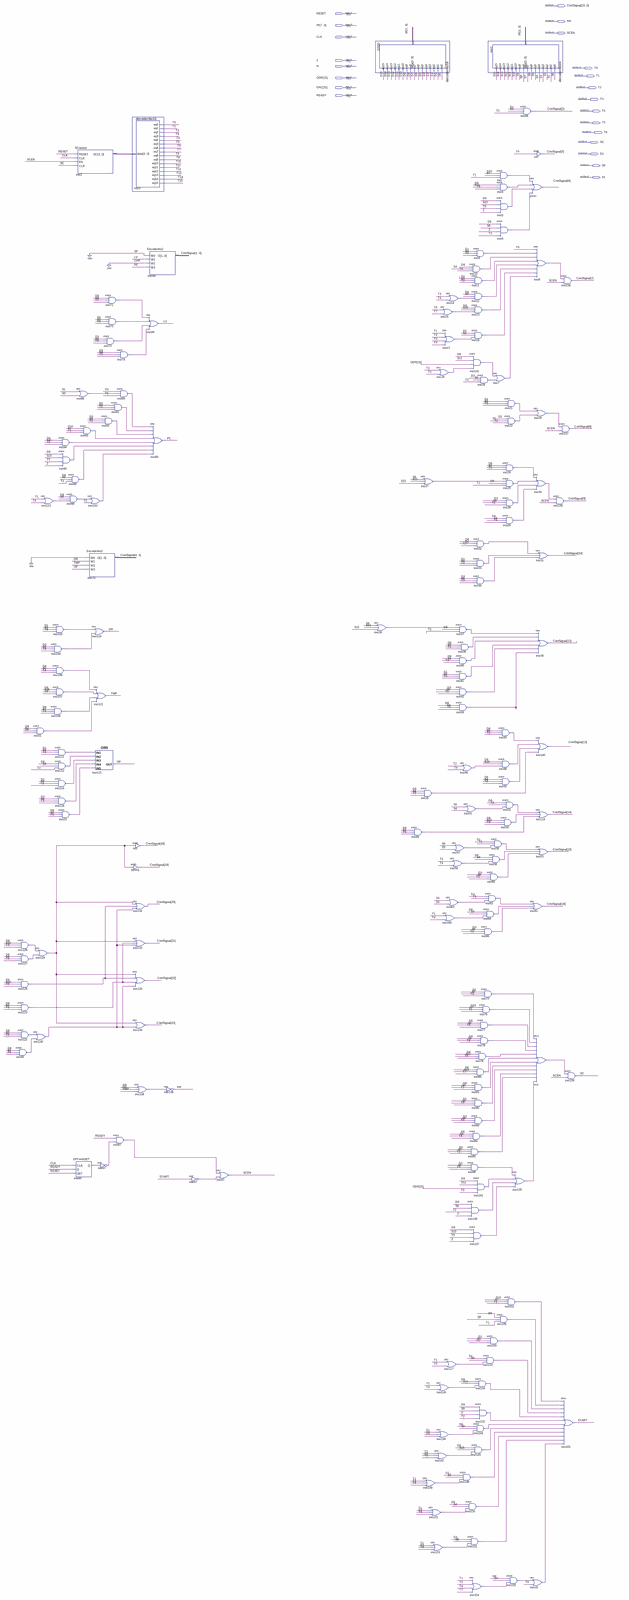
[diagram p0: schematic sheet, whole]
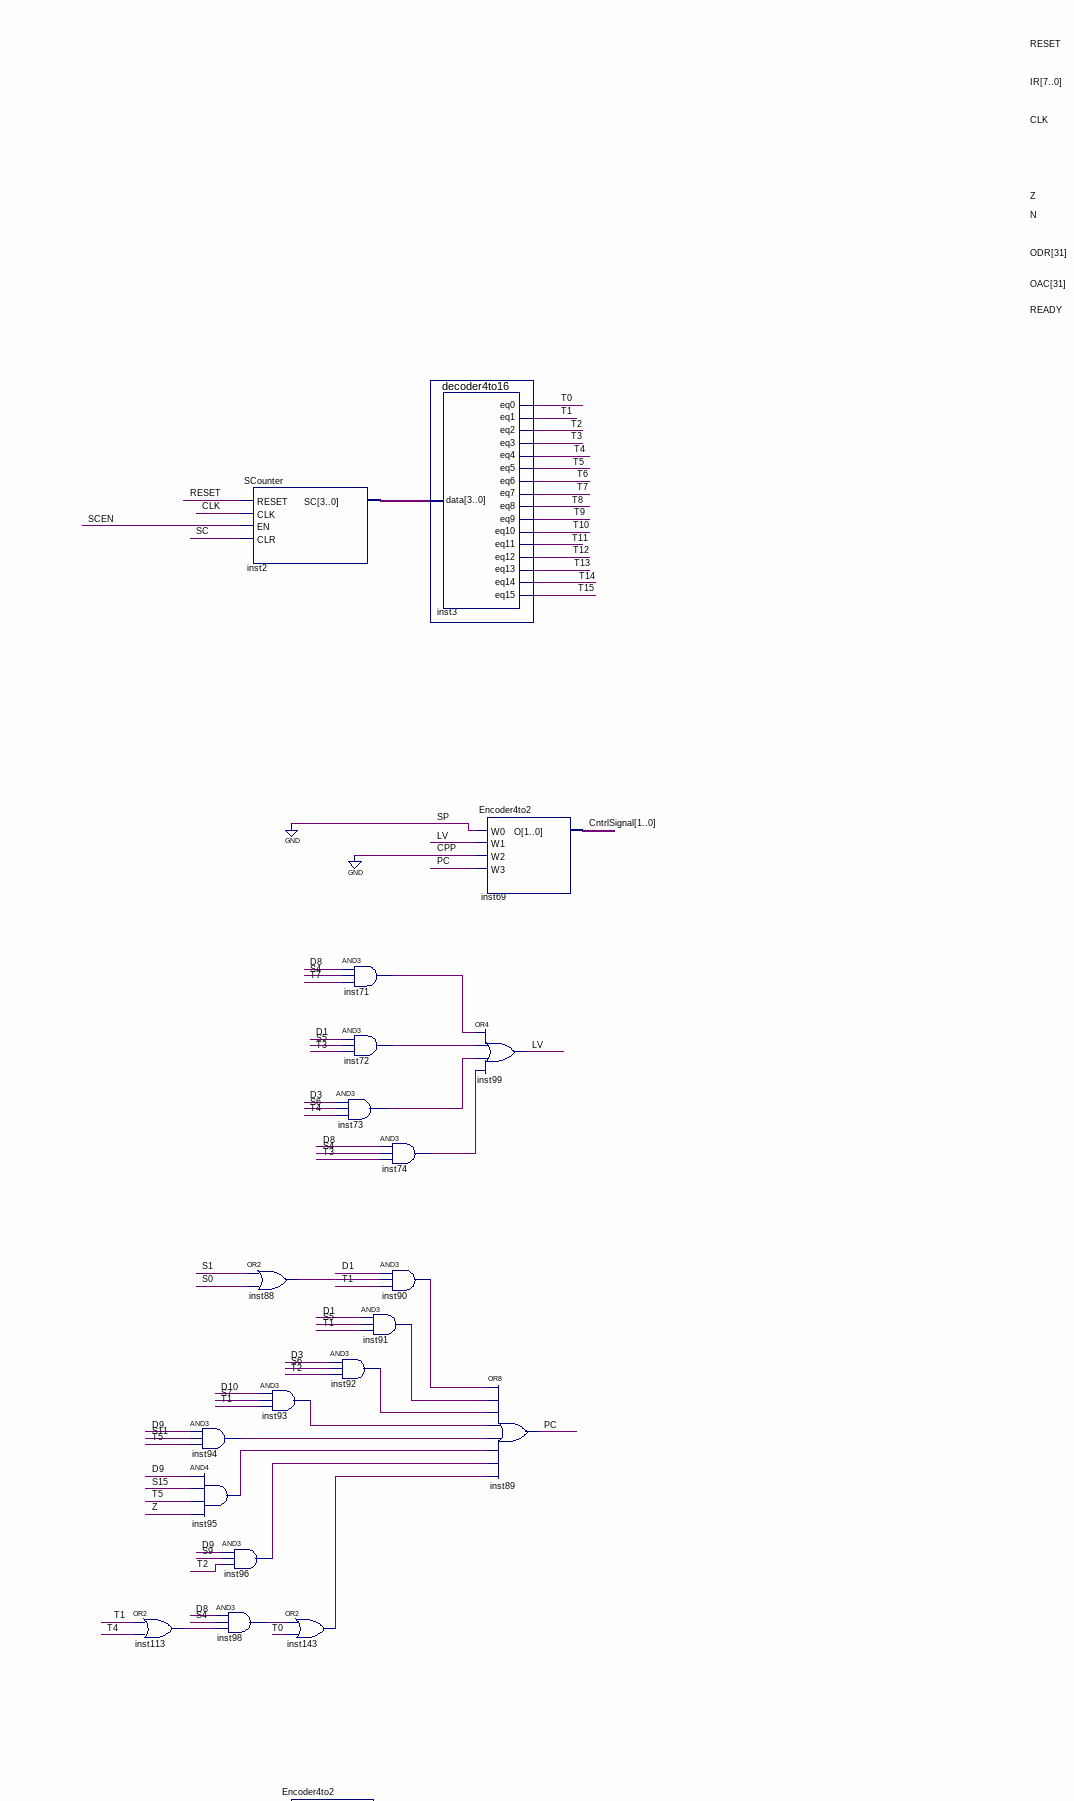
[diagram p1: schematic sheet, upper left part]
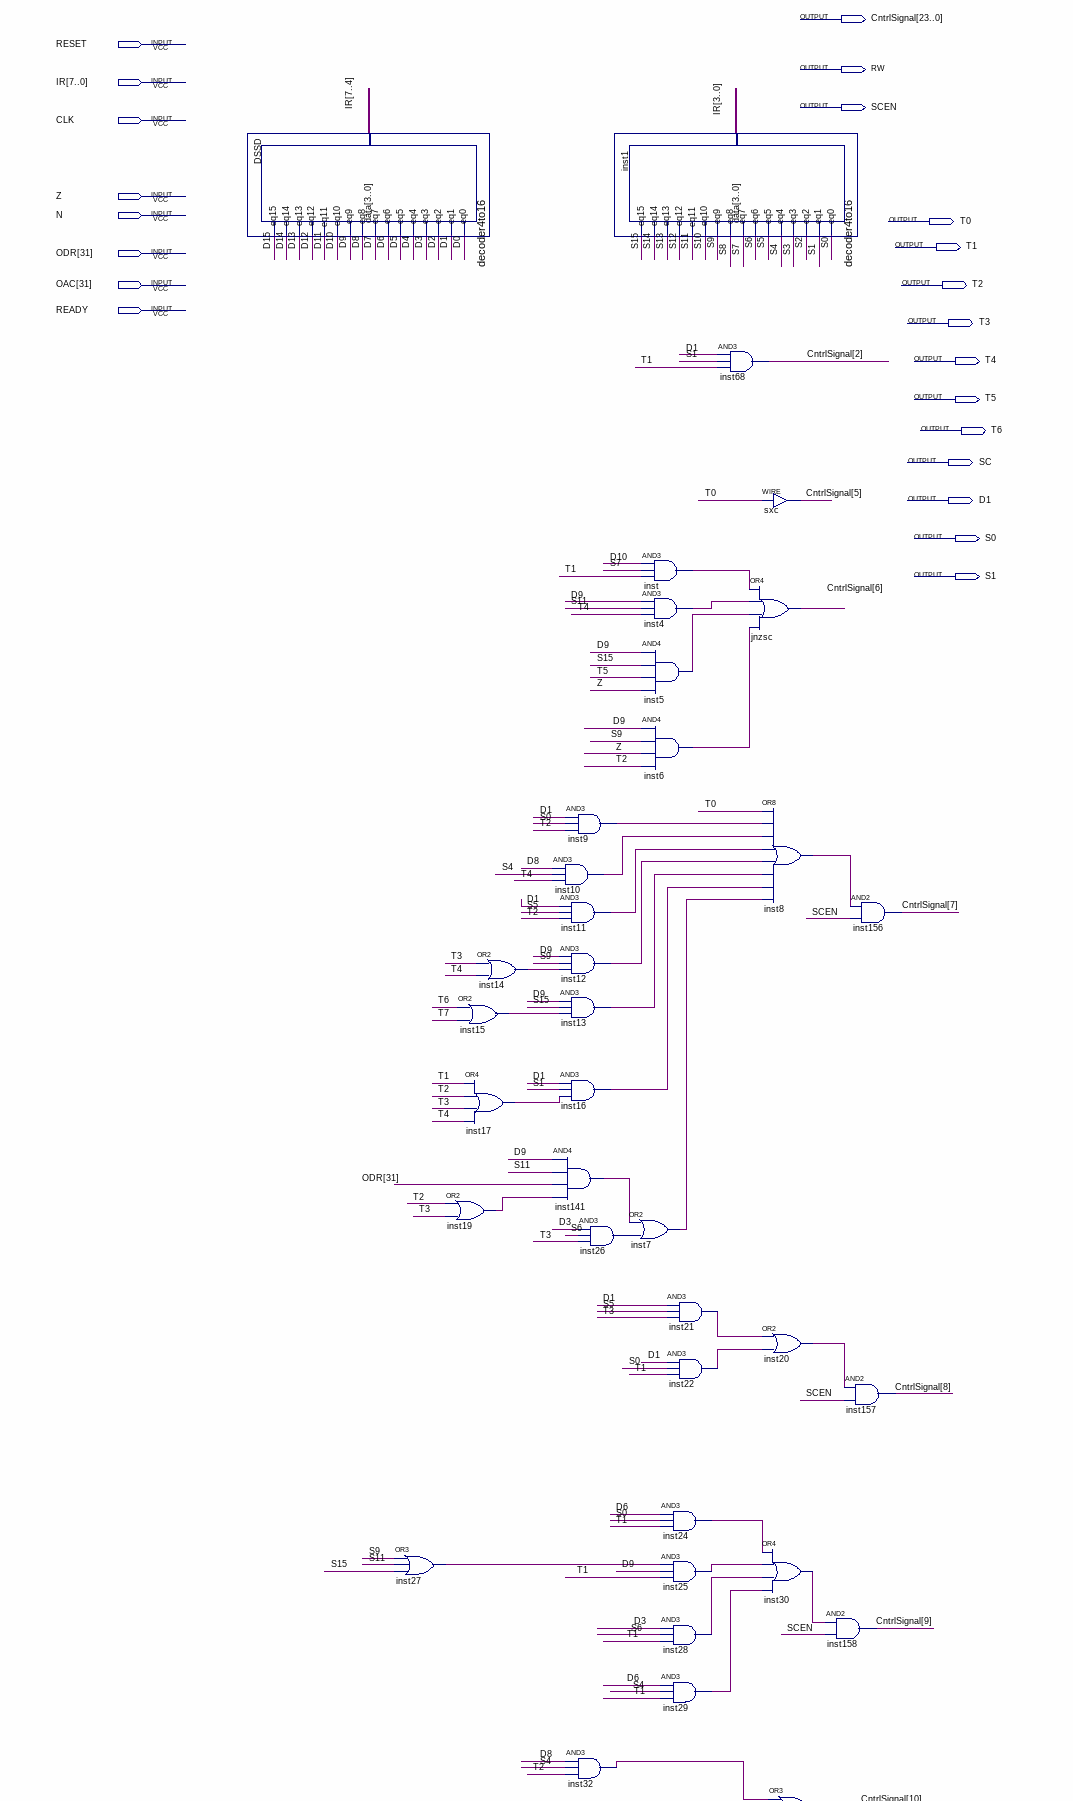
[diagram p2: schematic sheet, upper right part]
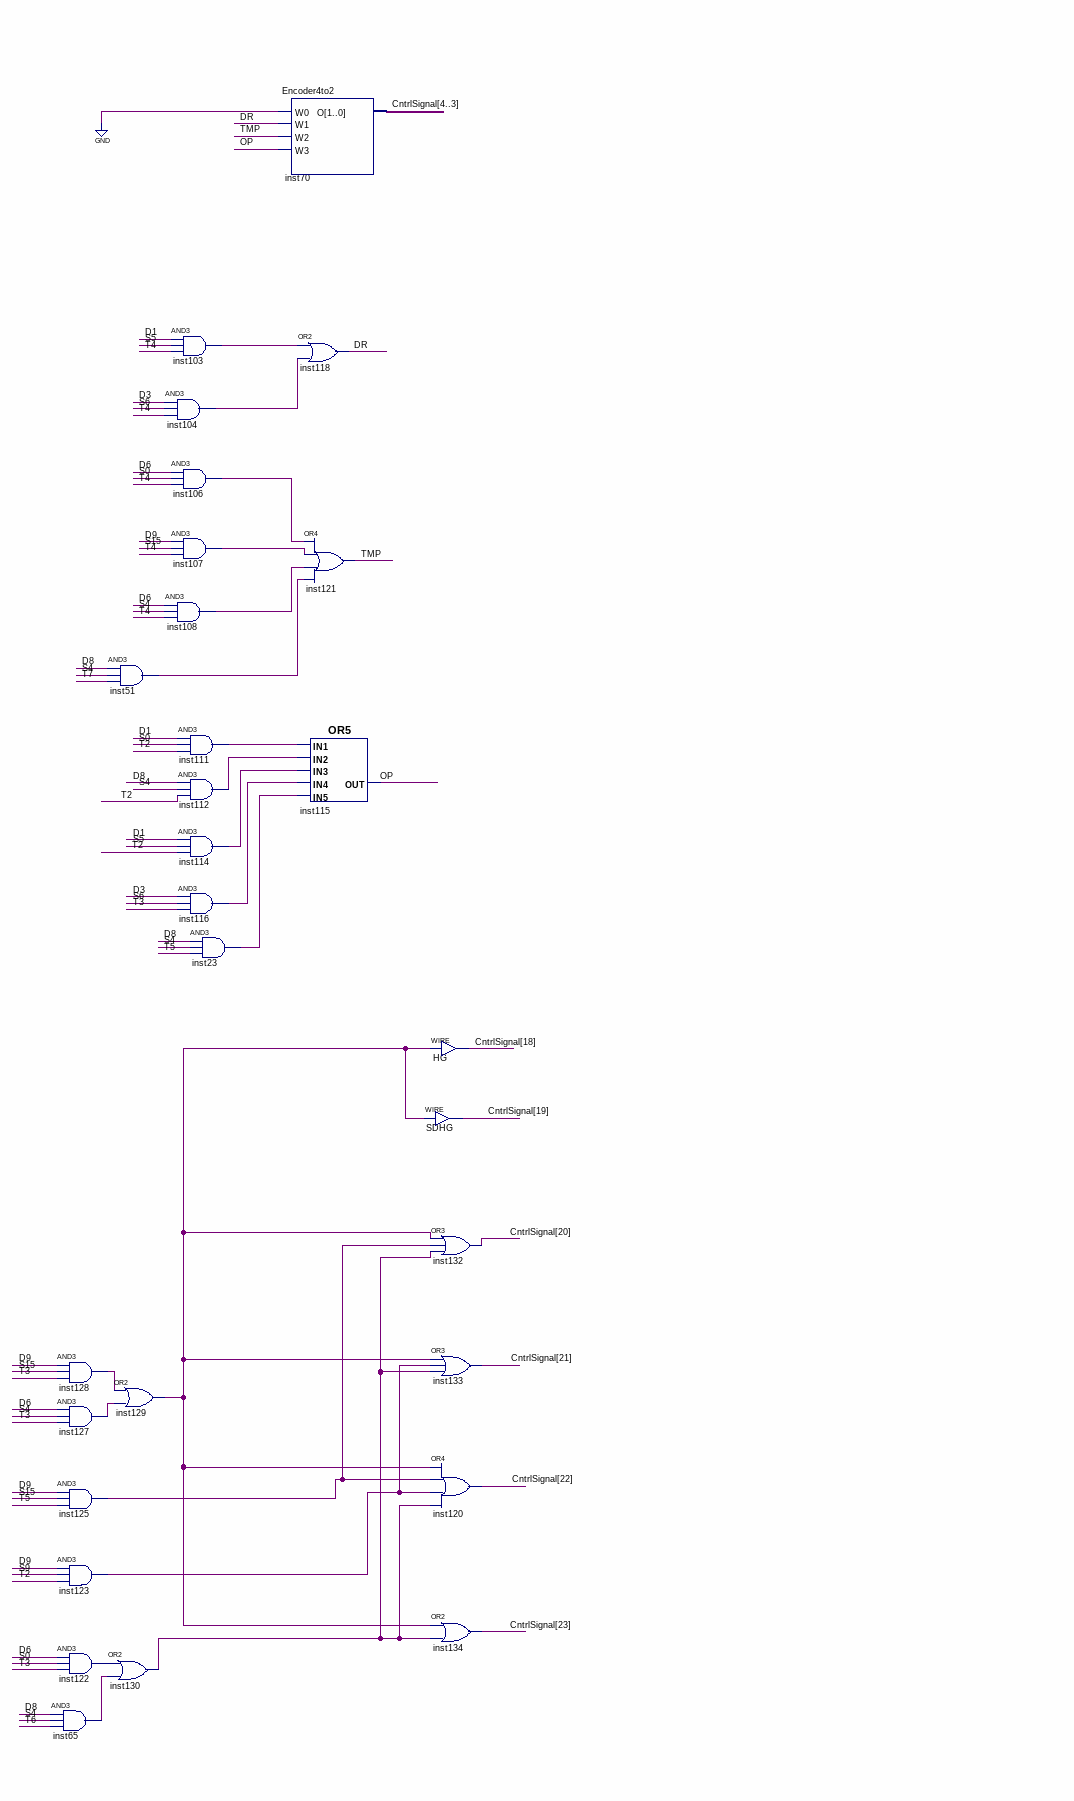
[diagram p3: schematic sheet, middle left part]
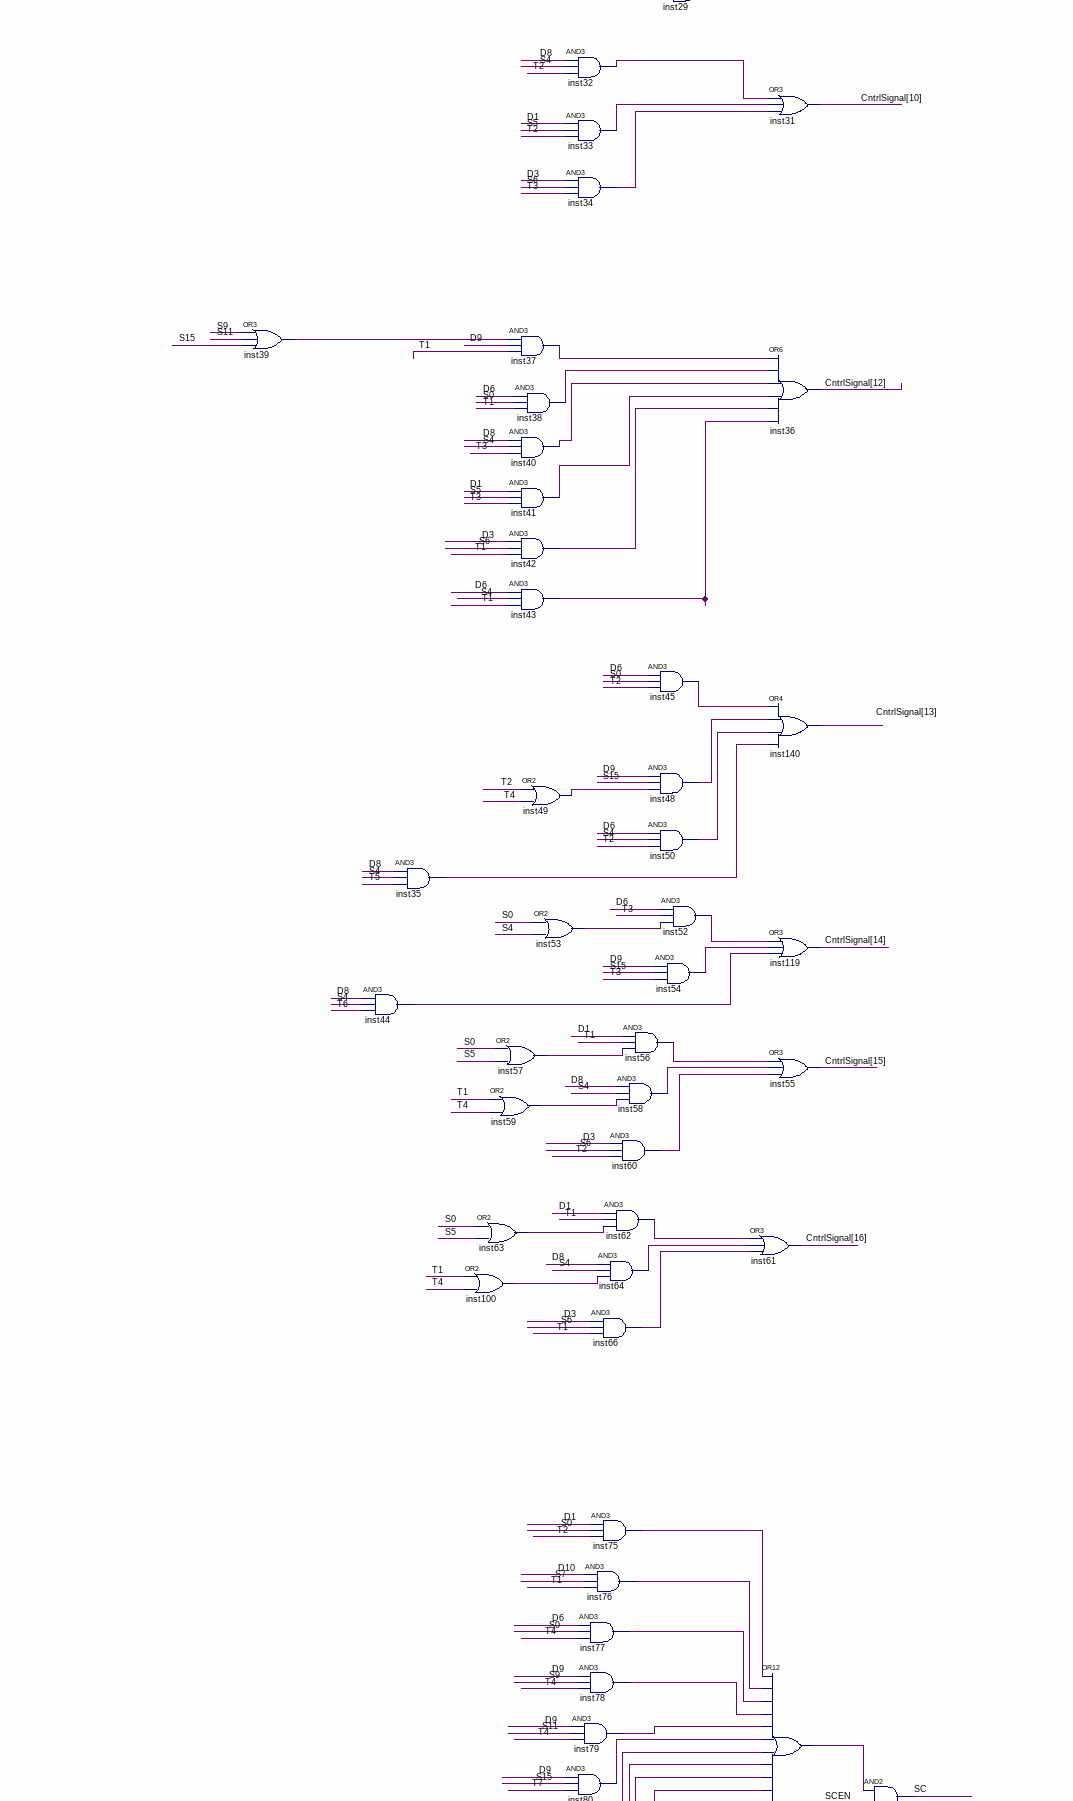
[diagram p4: schematic sheet, middle right part]
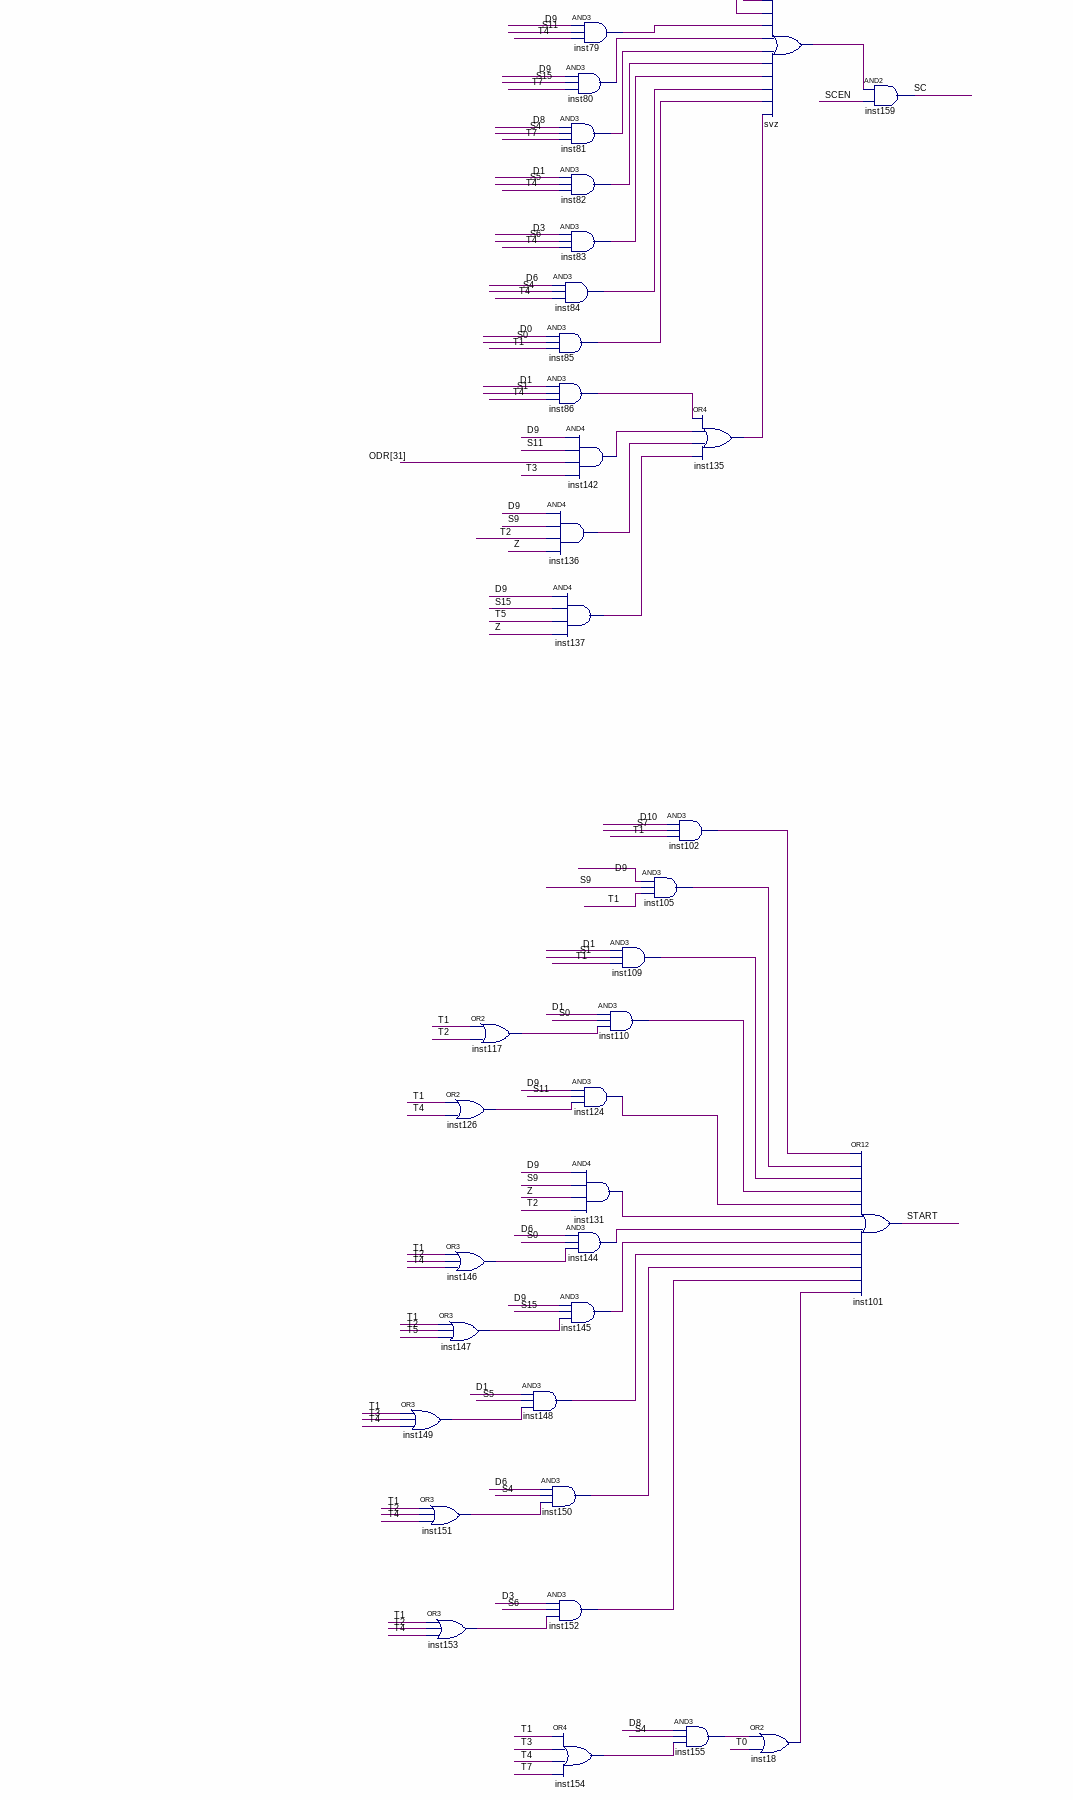
[diagram p5: schematic sheet, lower right part]
// Quartus schematic CU.bdf as structural Verilog: 166 symbols, 22 pins
module CU (
  input  RESET,
  input  [7:0] IR,
  input  CLK,
  input  Z,
  input  N,
  input  [31:31] ODR,
  input  [31:31] OAC,
  input  READY,
  output [23:0] CntrlSignal,
  output RW,
  output SCEN,
  output T0,
  output T1,
  output T2,
  output T3,
  output T4,
  output T5,
  output T6,
  output SC,
  output D1,
  output S0,
  output S1
);

  wire D0, D2, D3, D4, D5, D6, D7, D8, D9, D10, D11, D12, D13, D14, D15, DR, inst4_out, inst5_out, inst6_out,
       inst7_out, inst8_out, inst9_out, inst10_out, inst11_out, inst12_out, inst13_out, inst14_out,
       inst15_out, inst16_out, inst17_out, inst18_out, inst19_out, inst20_out, inst21_out, inst22_out,
       inst23_out, inst24_out, inst25_out, inst26_out, inst27_out, inst28_out, inst29_out, inst30_out,
       inst32_out, inst33_out, inst34_out, inst35_out, inst37_out, inst38_out, inst39_out, inst40_out,
       inst41_out, inst42_out, inst43_out, inst44_out, inst45_out, inst46_q, inst48_out, inst49_out,
       inst50_out, inst51_out, inst52_out, inst53_out, inst54_out, inst56_out, inst57_out, inst58_out,
       inst59_out, inst60_out, inst62_out, inst63_out, inst64_out, inst65_out, inst66_out, inst67_out,
       inst71_out, inst72_out, inst73_out, inst74_out, inst75_out, inst76_out, inst77_out, inst78_out,
       inst79_out, inst80_out, inst81_out, inst82_out, inst83_out, inst84_out, inst85_out, inst86_out,
       inst87_out, inst88_out, inst90_out, inst91_out, inst92_out, inst93_out, inst94_out, inst95_out,
       inst96_out, inst97_out, inst98_out, inst100_out, inst102_out, inst103_out, inst104_out, inst105_out,
       inst106_out, inst107_out, inst108_out, inst109_out, inst110_out, inst111_out, inst112_out,
       inst113_out, inst114_out, inst116_out, inst117_out, inst122_out, inst123_out, inst124_out,
       inst125_out, inst126_out, inst127_out, inst128_out, inst129_out, inst130_out, inst131_out,
       inst135_out, inst136_out, inst137_out, inst138_out, inst141_out, inst142_out, inst143_out,
       inst144_out, inst145_out, inst146_out, inst147_out, inst148_out, inst149_out, inst150_out,
       inst151_out, inst152_out, inst153_out, inst154_out, inst155_out, inst_out, LV, OP, PC, S2, S3, S4, S5,
       S6, S7, S8, S9, S10, S11, S12, S13, S14, S15, START, svz_out, T7, T8, T9, T10, T11, T12, T13, T14,
       T15, TMP;
  wire [3:0] inst2_sc;

  and inst65 (inst65_out, D8, S4, T6);
  and inst128 (inst128_out, D9, S15, T3);
  and inst127 (inst127_out, D6, S4, T3);
  and inst125 (inst125_out, D9, S15, T5);
  and inst123 (inst123_out, D9, S9, T2);
  and inst122 (inst122_out, D6, S0, T3);
  or inst113 (inst113_out, T1, T4);
  and inst51 (inst51_out, D8, S4, T7);
  or inst129 (inst129_out, inst128_out, inst127_out);
  or inst130 (inst130_out, inst122_out, inst65_out);
  and inst94 (inst94_out, D9, S11, T5);
  and inst95 (inst95_out, D9, S15, T5, Z);
  and inst103 (inst103_out, D1, S5, T4);
  and inst104 (inst104_out, D3, S6, T4);
  and inst106 (inst106_out, D6, S0, T4);
  and inst107 (inst107_out, D9, S15, T4);
  and inst108 (inst108_out, D6, S4, T4);
  and inst111 (inst111_out, D1, S0, T2);
  and inst112 (inst112_out, D8, S4, T2);
  and inst114 (inst114_out, D1, S5, T2);
  and inst116 (inst116_out, D3, S6, T3);
  and inst23 (inst23_out, D8, S4, T5);
  SCounter inst2 (.RESET(RESET), .CLK(CLK), .EN(SCEN), .CLR(SC), .SC(inst2_sc));
  or inst88 (inst88_out, S1, S0);
  and inst96 (inst96_out, D9, S9, T2);
  and inst98 (inst98_out, D8, S4, inst113_out);
  DFFwithSET inst46 (.CLK(CLK), .D(READY), .SET(RESET), .Q(inst46_q));
  and inst93 (inst93_out, D10, S7, T1);
  or inst143 (inst143_out, inst98_out, T0);
  Encoder4to2 inst70 (.W0(1'b0), .W1(DR), .W2(TMP), .W3(OP), .O(CntrlSignal[4:3]));
  or inst118 (DR, inst103_out, inst104_out);
  or inst121 (TMP, inst106_out, inst107_out, inst108_out, inst51_out);
  or inst115 (OP, inst111_out, inst112_out, inst114_out, inst116_out, inst23_out);
  and inst71 (inst71_out, D8, S4, T7);
  and inst72 (inst72_out, D1, S5, T3);
  and inst73 (inst73_out, D3, S6, T4);
  and inst92 (inst92_out, D3, S6, T2);
  not inst97 (inst97_out, inst46_q);
  and inst74 (inst74_out, D8, S4, T3);
  and inst90 (inst90_out, D1, inst88_out, T1);
  and inst91 (inst91_out, D1, S5, T1);
  and inst87 (inst87_out, READY, inst97_out);
  decoder4to16 inst3 (
    .data(inst2_sc), .eq0(T0), .eq1(T1), .eq2(T2), .eq3(T3), .eq4(T4), .eq5(T5), .eq6(T6), .eq7(T7),
    .eq8(T8), .eq9(T9), .eq10(T10), .eq11(T11), .eq12(T12), .eq13(T13), .eq14(T14), .eq15(T15));
  assign CntrlSignal[18] = inst129_out;  // WIRE HG
  assign CntrlSignal[19] = inst129_out;  // WIRE SDHG
  or inst132 (CntrlSignal[20], inst129_out, inst125_out, inst130_out);
  or inst133 (CntrlSignal[21], inst129_out, inst123_out, inst130_out);
  or inst120 (CntrlSignal[22], inst129_out, inst125_out, inst123_out, inst130_out);
  or inst134 (CntrlSignal[23], inst129_out, inst130_out);
  or inst138 (inst138_out, DR, OP, TMP);
  Encoder4to2 inst69 (.W0(1'b0), .W1(LV), .W2(1'b0), .W3(PC), .O(CntrlSignal[1:0]));
  or inst99 (LV, inst71_out, inst72_out, inst73_out, inst74_out);
  or inst89 (PC, inst90_out, inst91_out, inst92_out, inst93_out, inst94_out, inst95_out, inst96_out, inst143_out);
  not inst139 (RW, inst138_out);
  not inst67 (inst67_out, START);
  or inst47 (SCEN, inst87_out, inst67_out);
  or inst39 (inst39_out, S9, S11, S15);
  decoder4to16 DSSD (
    .data(IR[7:4]), .eq0(D0), .eq1(D1), .eq2(D2), .eq3(D3), .eq4(D4), .eq5(D5), .eq6(D6), .eq7(D7), .eq8(D8),
    .eq9(D9), .eq10(D10), .eq11(D11), .eq12(D12), .eq13(D13), .eq14(D14), .eq15(D15));
  or inst27 (inst27_out, S9, S11, S15);
  and inst35 (inst35_out, D8, S4, T5);
  and inst44 (inst44_out, D8, S4, T6);
  or inst19 (inst19_out, T2, T3);
  or inst126 (inst126_out, T1, T4);
  or inst146 (inst146_out, T1, T2, T4);
  or inst147 (inst147_out, T1, T2, T5);
  or inst149 (inst149_out, T1, T3, T4);
  or inst151 (inst151_out, T1, T2, T4);
  or inst153 (inst153_out, T1, T2, T4);
  or inst14 (inst14_out, T3, T4);
  or inst15 (inst15_out, T6, T7);
  or inst17 (inst17_out, T1, T2, T3, T4);
  or inst57 (inst57_out, S0, S5);
  or inst59 (inst59_out, T1, T4);
  or inst63 (inst63_out, S0, S5);
  or inst100 (inst100_out, T1, T4);
  or inst117 (inst117_out, T1, T2);
  and inst37 (inst37_out, inst39_out, D9, T1);
  and inst38 (inst38_out, D6, S0, T1);
  and inst40 (inst40_out, D8, S4, T3);
  and inst41 (inst41_out, D1, S5, T3);
  and inst42 (inst42_out, D3, S6, T1);
  and inst43 (inst43_out, D6, S4, T1);
  or inst49 (inst49_out, T2, T4);
  or inst53 (inst53_out, S0, S4);
  and inst85 (inst85_out, D0, S0, T1);
  and inst86 (inst86_out, D1, S1, T4);
  and inst136 (inst136_out, D9, S9, T2, Z);
  and inst148 (inst148_out, D1, S5, inst149_out);
  and inst150 (inst150_out, D6, S4, inst151_out);
  and inst152 (inst152_out, D3, S6, inst153_out);
  and inst9 (inst9_out, D1, S0, T2);
  and inst10 (inst10_out, D8, S4, T4);
  and inst11 (inst11_out, D1, S5, T2);
  and inst12 (inst12_out, D9, S9, inst14_out);
  and inst13 (inst13_out, D9, S15, inst15_out);
  and inst16 (inst16_out, D1, S1, inst17_out);
  and inst141 (inst141_out, D9, S11, ODR[31], inst19_out);
  and inst26 (inst26_out, D3, S6, T3);
  and inst32 (inst32_out, D8, S4, T2);
  and inst33 (inst33_out, D1, S5, T2);
  and inst34 (inst34_out, D3, S6, T3);
  and inst64 (inst64_out, D8, S4, inst100_out);
  and inst66 (inst66_out, D3, S6, T1);
  and inst75 (inst75_out, D1, S0, T2);
  and inst76 (inst76_out, D10, S7, T1);
  and inst77 (inst77_out, D6, S0, T4);
  and inst78 (inst78_out, D9, S9, T4);
  and inst79 (inst79_out, D9, S11, T4);
  and inst80 (inst80_out, D9, S15, T7);
  and inst81 (inst81_out, D8, S4, T7);
  and inst82 (inst82_out, D1, S5, T4);
  and inst83 (inst83_out, D3, S6, T4);
  and inst84 (inst84_out, D6, S4, T4);
  and inst142 (inst142_out, D9, S11, ODR[31], T3);
  and inst137 (inst137_out, D9, S15, T5, Z);
  and inst110 (inst110_out, D1, S0, inst117_out);
  and inst124 (inst124_out, D9, S11, inst126_out);
  and inst131 (inst131_out, D9, S9, Z, T2);
  and inst144 (inst144_out, D6, S0, inst146_out);
  and inst145 (inst145_out, D9, S15, inst147_out);
  or inst154 (inst154_out, T1, T3, T4, T7);
  decoder4to16 inst1 (
    .data(IR[3:0]), .eq0(S0), .eq1(S1), .eq2(S2), .eq3(S3), .eq4(S4), .eq5(S5), .eq6(S6), .eq7(S7), .eq8(S8),
    .eq9(S9), .eq10(S10), .eq11(S11), .eq12(S12), .eq13(S13), .eq14(S14), .eq15(S15));
  and inst (inst_out, D10, S7, T1);
  and inst4 (inst4_out, D9, S11, T4);
  and inst5 (inst5_out, D9, S15, T5, Z);
  and inst6 (inst6_out, D9, S9, Z, T2);
  or inst7 (inst7_out, inst141_out, inst26_out);
  and inst45 (inst45_out, D6, S0, T2);
  and inst48 (inst48_out, D9, S15, inst49_out);
  and inst50 (inst50_out, D6, S4, T2);
  and inst56 (inst56_out, D1, T1, inst57_out);
  and inst58 (inst58_out, D8, S4, inst59_out);
  and inst60 (inst60_out, D3, S6, T2);
  and inst62 (inst62_out, D1, T1, inst63_out);
  and inst105 (inst105_out, D9, S9, T1);
  and inst109 (inst109_out, D1, S1, T1);
  and inst21 (inst21_out, D1, S5, T3);
  and inst22 (inst22_out, D1, S0, T1);
  and inst24 (inst24_out, D6, S0, T1);
  and inst25 (inst25_out, inst27_out, D9, T1);
  and inst28 (inst28_out, D3, S6, T1);
  and inst29 (inst29_out, D6, S4, T1);
  and inst52 (inst52_out, D6, T3, inst53_out);
  and inst54 (inst54_out, D9, S15, T3);
  or inst135 (inst135_out, inst86_out, inst142_out, inst136_out, inst137_out);
  and inst102 (inst102_out, D10, S7, T1);
  and inst155 (inst155_out, D8, S4, inst154_out);
  and inst68 (CntrlSignal[2], D1, S1, T1);
  or jnzsc (CntrlSignal[6], inst_out, inst4_out, inst5_out, inst6_out);
  or inst61 (CntrlSignal[16], inst62_out, inst64_out, inst66_out);
  or inst18 (inst18_out, inst155_out, T0);
  assign CntrlSignal[5] = T0;  // WIRE sxc
  or inst8 (inst8_out, T0, inst9_out, inst10_out, inst11_out, inst12_out, inst13_out, inst16_out, inst7_out);
  or inst20 (inst20_out, inst21_out, inst22_out);
  or inst30 (inst30_out, inst24_out, inst25_out, inst28_out, inst29_out);
  or inst31 (CntrlSignal[10], inst32_out, inst33_out, inst34_out);
  or inst36 (CntrlSignal[12], inst37_out, inst38_out, inst40_out, inst41_out, inst42_out, inst43_out);
  or inst140 (CntrlSignal[13], inst45_out, inst48_out, inst50_out, inst35_out);
  or inst119 (CntrlSignal[14], inst52_out, inst54_out, inst44_out);
  or inst55 (CntrlSignal[15], inst56_out, inst58_out, inst60_out);
  or svz (svz_out, inst75_out, inst76_out, inst77_out, inst78_out, inst79_out, inst80_out, inst81_out, inst82_out, inst83_out, inst84_out, inst85_out, inst135_out);
  and inst156 (CntrlSignal[7], inst8_out, SCEN);
  and inst157 (CntrlSignal[8], inst20_out, SCEN);
  and inst158 (CntrlSignal[9], inst30_out, SCEN);
  or inst101 (START, inst102_out, inst105_out, inst109_out, inst110_out, inst124_out, inst131_out, inst144_out, inst145_out, inst148_out, inst150_out, inst152_out, inst18_out);
  and inst159 (SC, svz_out, SCEN);
endmodule
